# Altium schematic sheet Red_LED.SchDoc: Red LED
size A4
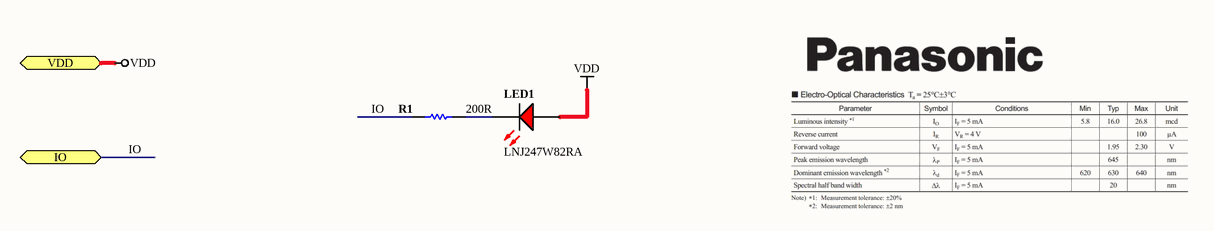
[diagram p0: Red_LED.SchDoc]

## Parts
LED1  LNJ247W82RA  [PNSC-CHIP-2_V]
R1  value 200R  [RESC0402(1005)_N]  (hidden comment: 200R 5% 0402(1005))

## Ports
IO, VDD

## Nets
VDD: LED1.1(ANODE) ; port VDD
IO: R1.1 ; port IO
NetLED1_2: LED1.2(CATHODE) R1.2

## Notes on the sheet
- Sheet Title
- Project Title
- Size:
- Date:
- A4
- Item:
- Time:
- Revision:
- Sheet
- of
- File:

## Library data of the parts
LED1 = CMP-0456-00001-1: Hight Bright Surface Mounting Chip LED (Red), 55 mW, -30 to 85 degC, 1.0 x 0.5 x 0.2 mm SMD; Manufacturer: Panasonic; Spectral half band width: 20 nm; Peak Emission Wavelength: 645 nm; Dominant Emission Wavelength: 630 nm; Forward Voltage: 1.95 V; Luminous Intensity: 16 mcd; Reverse Current: 100 uA; Mounting Technology: Surface Mount; ComponentLink3URL: http://www.semicon.panasonic.co.jp/ds4/LNJ247W82RA_E.pdf; ComponentLink3Description: Package Specification; ComponentLink1Description: Manufacturer URL; ComponentLink2Description: Datasheet; PackageReference: CHIP-2; ComponentLink1URL: http://www.semicon.panasonic.co.jp/en/; PartNumber: LNJ247W82RA; PackageDescription: 2-Pin CHIP, Body 1x0.5mm, Pitch 0.7mm; ComponentLink2URL: http://www.semicon.panasonic.co.jp/ds4/LNJ247W82RA_E.pdf
R1 = CMP-1011-00057-1: 200R 0.063W 5% 0402 (1005 Metric)  SMD; Case-Metric: 1005; Case-EIA: 0402; Technology: SMT; Power: 0.063 W; Tolerance: 5 %